# Altium schematic sheet CMX994AQ4.SchDoc
size A3; SheetNumber: 1; SheetTotal: 1
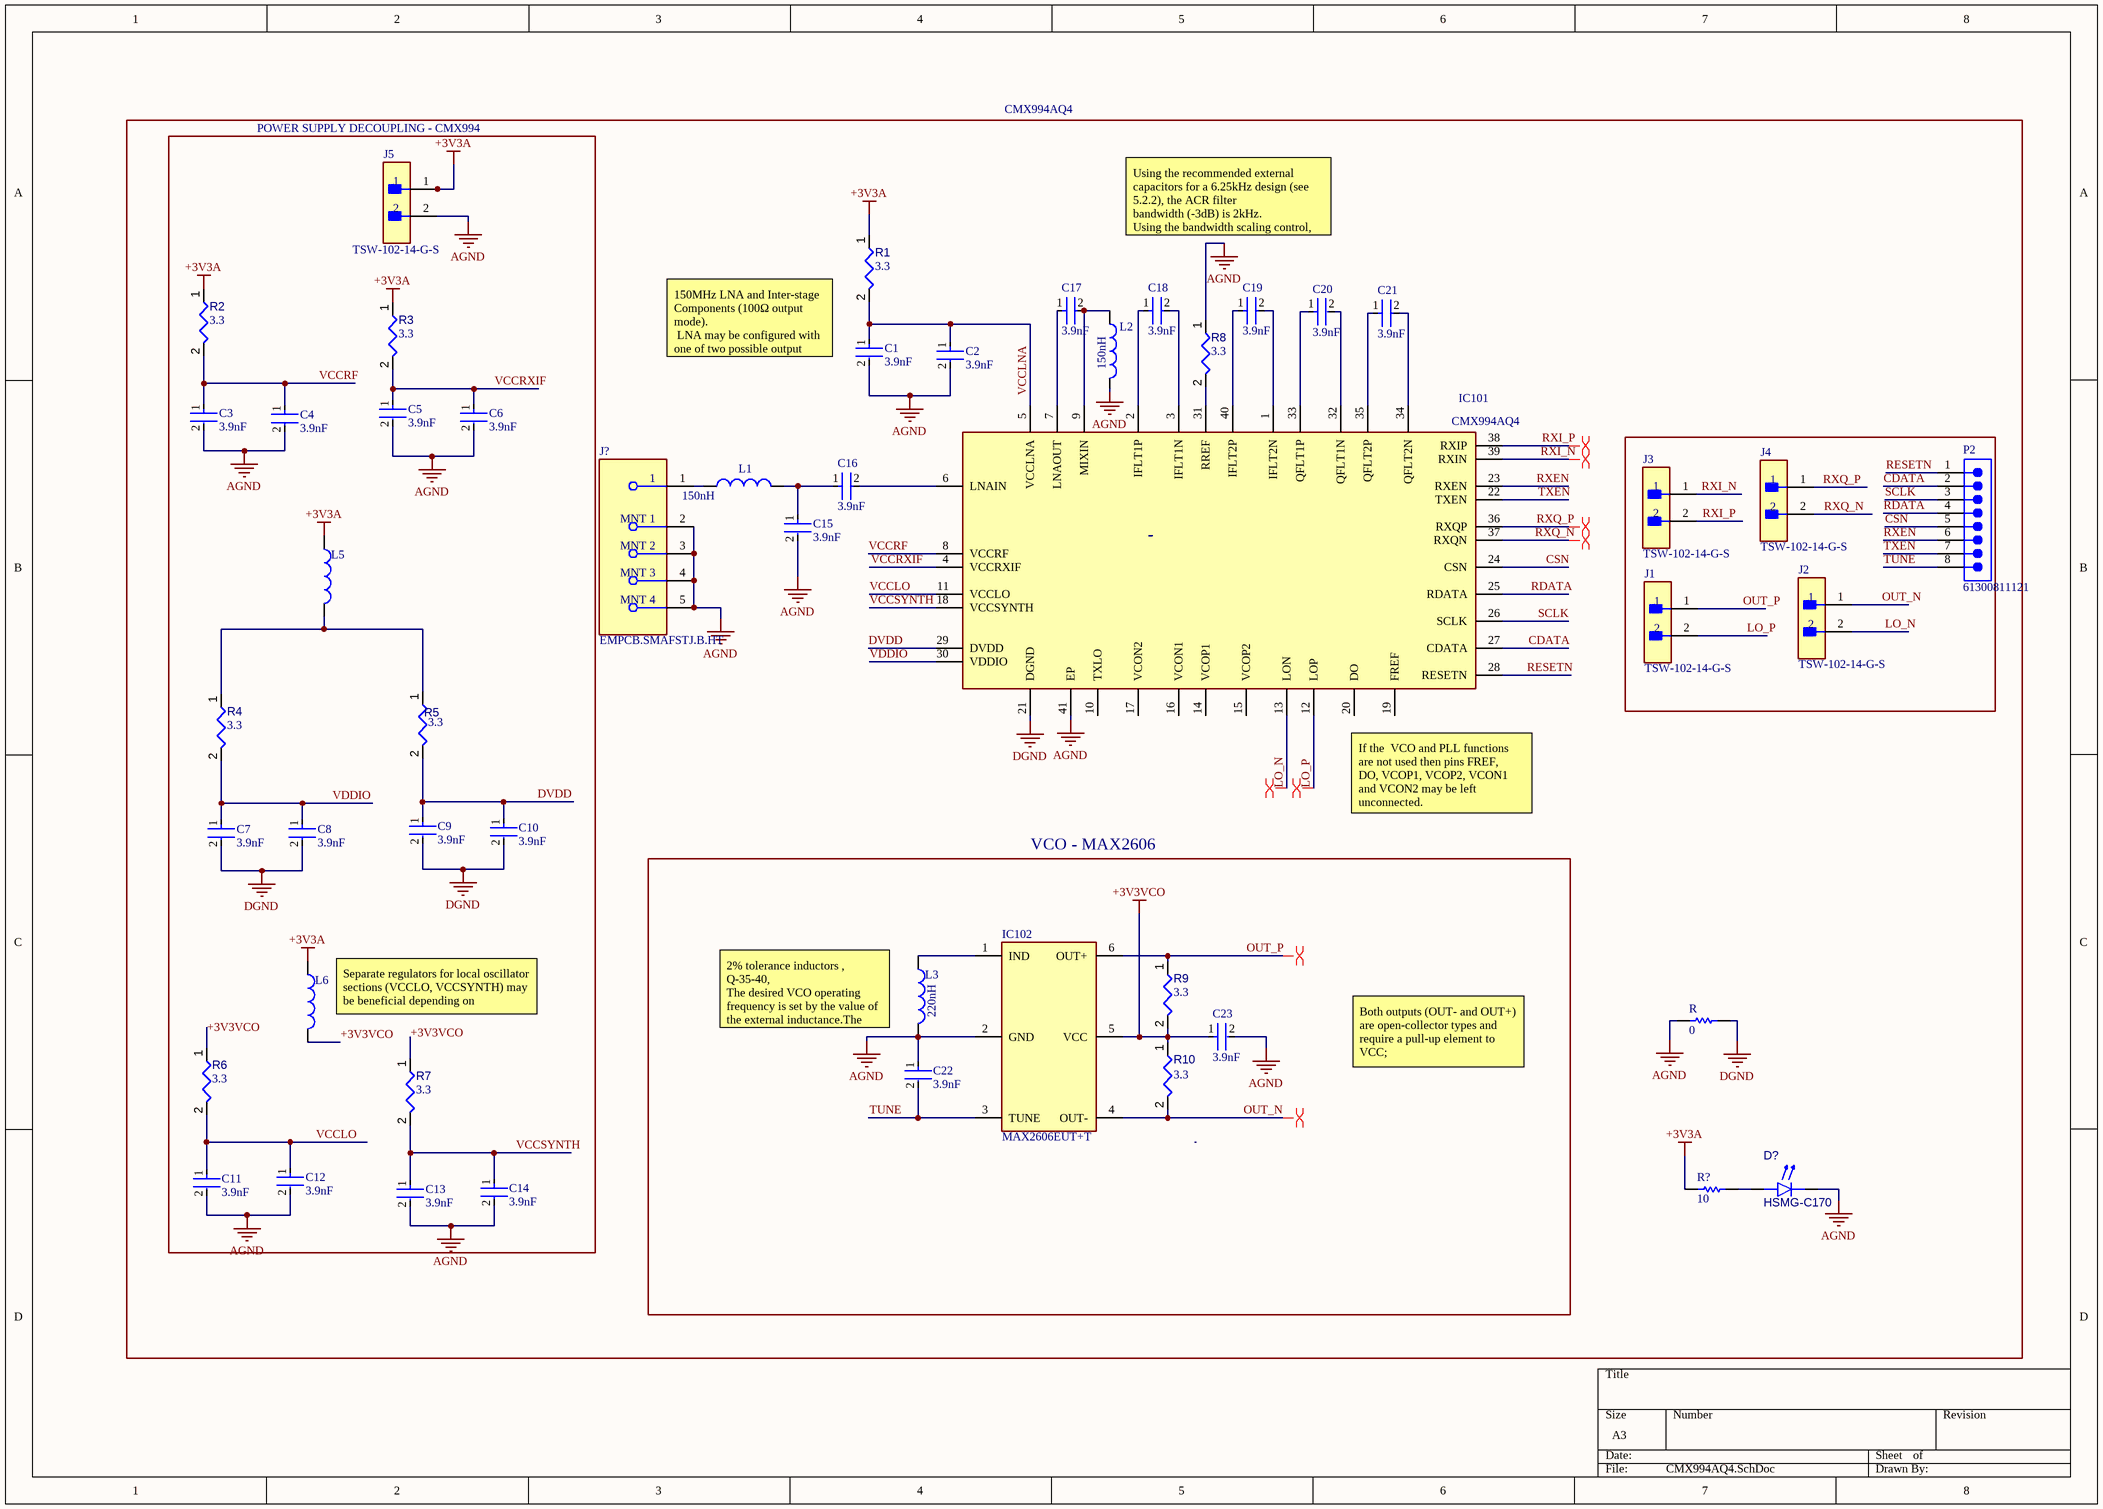
[diagram p0: CMX994AQ4.SchDoc]

## Parts
C1  value 3.9nF  [FP-CL10-IPC_B]  (hidden comment: CL10B392KB8NNND)
C2  value 3.9nF  [FP-CL10-IPC_B]  (hidden comment: CL10B392KB8NNND)
C3  value 3.9nF  [FP-CL10-IPC_B]  (hidden comment: CL10B392KB8NNND)
C4  value 3.9nF  [FP-CL10-IPC_B]  (hidden comment: CL10B392KB8NNND)
C5  value 3.9nF  [FP-CL10-IPC_B]  (hidden comment: CL10B392KB8NNND)
C6  value 3.9nF  [FP-CL10-IPC_B]  (hidden comment: CL10B392KB8NNND)
C7  value 3.9nF  [FP-CL10-IPC_B]  (hidden comment: CL10B392KB8NNND)
C8  value 3.9nF  [FP-CL10-IPC_B]  (hidden comment: CL10B392KB8NNND)
C9  value 3.9nF  [FP-CL10-IPC_B]  (hidden comment: CL10B392KB8NNND)
C10  value 3.9nF  [FP-CL10-IPC_B]  (hidden comment: CL10B392KB8NNND)
C11  value 3.9nF  [FP-CL10-IPC_B]  (hidden comment: CL10B392KB8NNND)
C12  value 3.9nF  [FP-CL10-IPC_B]  (hidden comment: CL10B392KB8NNND)
C13  value 3.9nF  [FP-CL10-IPC_B]  (hidden comment: CL10B392KB8NNND)
C14  value 3.9nF  [FP-CL10-IPC_B]  (hidden comment: CL10B392KB8NNND)
C15  value 3.9nF  [FP-CL10-IPC_B]  (hidden comment: CL10B392KB8NNND)
C16  value 3.9nF  [FP-CL10-IPC_B]  (hidden comment: CL10B392KB8NNND)
C17  value 3.9nF  [FP-CL10-IPC_B]  (hidden comment: CL10B392KB8NNND)
C18  value 3.9nF  [FP-CL10-IPC_B]  (hidden comment: CL10B392KB8NNND)
C19  value 3.9nF  [FP-CL10-IPC_B]  (hidden comment: CL10B392KB8NNND)
C20  value 3.9nF  [FP-CL10-IPC_B]  (hidden comment: CL10B392KB8NNND)
C21  value 3.9nF  [FP-CL10-IPC_B]  (hidden comment: CL10B392KB8NNND)
C22  value 3.9nF  [FP-CL10-IPC_B]  (hidden comment: CL10B392KB8NNND)
C23  value 3.9nF  [FP-CL10-IPC_B]  (hidden comment: CL10B392KB8NNND)
D?  HSMG-C170  [AVAG-HSMX-C170_V]
IC101  CMX994AQ4  [QFN50P600X600X100-41N-D]
IC102  MAX2606EUT+T  [SOT95P280X145-6N]
J1  TSW-102-14-G-S  [FP-TSW-102-14-G-S-MFG]
J2  TSW-102-14-G-S  [FP-TSW-102-14-G-S-MFG]
J3  TSW-102-14-G-S  [FP-TSW-102-14-G-S-MFG]
J4  TSW-102-14-G-S  [FP-TSW-102-14-G-S-MFG]
J5  TSW-102-14-G-S  [FP-TSW-102-14-G-S-MFG]
J?  EMPCB.SMAFSTJ.B.HT  [FP-EMPCB_SMAFSTJ_B_HT-MFG]
L1  LQM18NNR22K00D  [FP-LQM18NN_00-IPC_B]  (value not drawn)
L2  LQM18NNR22K00D  [FP-LQM18NN_00-IPC_B]  (value not drawn)
L3  LQM18NNR22K00D  [FP-LQM18NN_00-IPC_B]  (value not drawn)
L5  7427920415  [FP-7427920415-MFG]  (value not drawn)
L6  7427920415  [FP-7427920415-MFG]  (value not drawn)
P2  61300811121  [61300811121]
R  value 0  [RESC1608X55X25ML10T15]  (hidden comment: Resistor 0R +/- 5% 0603 100 mW)
R1  value 3.3  [RESC1608X55X25ML10T15]  (hidden comment: RC0603JR-073R3L)
R2  value 3.3  [RESC1608X55X25ML10T15]  (hidden comment: RC0603JR-073R3L)
R3  value 3.3  [RESC1608X55X25ML10T15]  (hidden comment: RC0603JR-073R3L)
R4  value 3.3  [RESC1608X55X25ML10T15]  (hidden comment: RC0603JR-073R3L)
R5  value 3.3  [RESC1608X55X25ML10T15]  (hidden comment: RC0603JR-073R3L)
R6  value 3.3  [RESC1608X55X25ML10T15]  (hidden comment: RC0603JR-073R3L)
R7  value 3.3  [RESC1608X55X25ML10T15]  (hidden comment: RC0603JR-073R3L)
R8  value 3.3  [RESC1608X55X25ML10T15]  (hidden comment: RC0603JR-073R3L)
R9  value 3.3  [RESC1608X55X25ML10T15]  (hidden comment: RC0603JR-073R3L)
R10  value 3.3  [RESC1608X55X25ML10T15]  (hidden comment: RC0603JR-073R3L)
R?  value 10  [RESC2013X50X30ML20T20]  (hidden comment: CRCW080510R0FKEA)

## Blocks framed on the sheet
POWER SUPPLY DECOUPLING - CMX994: C3-C14 J5 L5 L6 R2-R7
VCO - MAX2606: C22 C23 IC102 L3 R9 R10

## Nets
+3V3A: J5.1 L5.1 L6.1 R1.1 R2.1 R3.1 R?.1
+3V3VCO: C23.1 IC102.5(VCC) L6.2 R6.1 R7.1 R9.2 R10.1
AGND: C1.2 C2.2 C3.2 C4.2 C5.2 C6.2 C11.2 C12.2 C13.2 C14.2 C15.2 C22.1 C23.2 D?.1(K) IC101.41(EP) IC102.2(GND) J5.2 J?.2(MNT_1) J?.3(MNT_2) J?.4(MNT_3) J?.5(MNT_4) L2.2 L3.2 R.1 R8.1
DGND: C7.2 C8.2 C9.2 C10.2 IC101.21(DGND) R.2
CDATA: IC101.27(CDATA) P2.2
CSN: IC101.24(CSN) P2.5
DVDD: C9.1 C10.1 IC101.29(DVDD) R5.2
LO_N: IC101.13(LON) J2.2
LO_P: IC101.12(LOP) J1.2
OUT_N: IC102.4(OUT-) J2.1 R10.2
OUT_P: IC102.6(OUT+) J1.1 R9.1
RDATA: IC101.25(RDATA) P2.4
RESETN: IC101.28(RESETN) P2.1
RXEN: IC101.23(RXEN) P2.6
RXI_N: IC101.39(RXIN) J3.1
RXI_P: IC101.38(RXIP) J3.2
RXQ_N: IC101.37(RXQN) J4.2
RXQ_P: IC101.36(RXQP) J4.1
SCLK: IC101.26(SCLK) P2.3
TUNE: C22.2 IC102.3(TUNE) P2.8
TXEN: IC101.22(TXEN) P2.7
VCCLNA: C1.1 C2.1 IC101.5(VCCLNA) R1.2
VCCLO: C11.1 C12.1 IC101.11(VCCLO) R6.2
VCCRF: C3.1 C4.1 IC101.8(VCCRF) R2.2
VCCRXIF: C5.1 C6.1 IC101.4(VCCRXIF) R3.2
VCCSYNTH: C13.1 C14.1 IC101.18(VCCSYNTH) R7.2
VDDIO: C7.1 C8.1 IC101.30(VDDIO) R4.2
NetC15_1: C15.1 C16.1 L1.2
NetC16_2: C16.2 IC101.6(LNAIN)
NetC17_1: C17.1 IC101.7(LNAOUT)
NetC17_2: C17.2 IC101.9(MIXIN) L2.1
NetC18_1: C18.1 IC101.2(IFLT1P)
NetC18_2: C18.2 IC101.3(IFLT1N)
NetC19_1: C19.1 IC101.40(IFLT2P)
NetC19_2: C19.2 IC101.1(IFLT2N)
NetC20_1: C20.1 IC101.33(QFLT1P)
NetC20_2: C20.2 IC101.32(QFLT1N)
NetC21_1: C21.1 IC101.35(QFLT2P)
NetC21_2: C21.2 IC101.34(QFLT2N)
NetD?_2: D?.2(A) R?.2
NetIC101_31: IC101.31(RREF) R8.2
NetIC102_1: IC102.1(IND) L3.1
NetJ?_1: J?.1 L1.1
NetL5_2: L5.2 R4.1 R5.1

Not connected (* = marked no-connect by the designer): IC101 10(TXLO) 14(VCOP1) 15(VCOP2) 16(VCON1) 17(VCON2) 19(FREF) 20(DO)

## Layout directives
differential pair: LO_N, LO_P, OUT_N, OUT_P, RXI_N, RXI_P, RXQ_N, RXQ_P

## Notes on the sheet
- CMX994AQ4
- Using the recommended external capacitors for a 6.25kHz design (see 5.2.2), the ACR filter
  bandwidth (-3dB) is 2kHz.
  Using the bandwidth scaling control, the 2kHz filter bandwidth can then be changed to 4kHz or 8kHz (see Rx
  Control Register, section 7.3)
- 150MHz LNA and Inter-stage Components (100Ω output mode).
  LNA may be configured with one of two possible output impedance settings (100 ohm or 5 ohm). With the 50 ohm
  mode selected, there is more gain available but the circuit will consume an additional 2mA of current. The
  50 ohm mode has primarily been included for use at frequencies of 450MHz or higher.
- (near L2) 150nH
- (near L1) 150nH
- (near IC101) If the  VCO and PLL functions are not used then pins FREF,
  DO, VCOP1, VCOP2, VCON1 and VCON2 may be left unconnected.
- (near L6) Separate regulators for local oscillator sections (VCCLO, VCCSYNTH) may be beneficial depending on
  circuit noise and type of regulator and this is why two AVDD connections are shown.
- (near L3) 2% tolerance inductors , Q-35-40,
  The desired VCO operating frequency is set by the value of the external inductance.The inductor value can be taken directly from figure 2.
  Proper operation of the VCOs
  requires the use of this bypass capacitor
- (near L3) 220nH
- Both outputs (OUT- and OUT+) are open-collector types and require a pull-up element to VCC;
  C1 and C2 was selected to operating frequency of 137 Mhz
- Labels drawn without touching a wire or pin: \

## Library data of the parts
C1-C23 = CMP-001-00084-1: Ceramic Capacitor, Multilayer, Ceramic, 50V, 10% +Tol, 10% -Tol, X7R, 15% TC, 0.0039uF, Surface Mount, 0603; Case/Package: 0603; Mounting Technology: Surface Mount; Capacitor Type: Ceramic; Max Operating Temperature: 125°C; Min Operating Temperature: -55°C; RoHS Compliant: Yes; Pins: 2
D? = CMP-007-00036-1: Single Color LED, Green, Untinted Diffused, 1.4mm; Forward Voltage: 2.6V; Forward Current: 20mA; Min Operating Temperature: -40°C; Max Operating Temperature: 85°C; RoHS Compliant: Yes; Pins: 2; Mounting Technology: Surface Mount
IC101 = CMX994AQ4: Integrated Circuit; Manufacturer_Name: CML Microcircuits; Datasheet Link: https://www.mouser.in/datasheet/2/976/cml_referer_download-1660539.pdf; Height: 1mm; Manufacturer_Part_Number: CMX994AQ4; Mouser Part Number: 226-CMX994AQ4; Mouser Price/Stock: https://www.mouser.co.uk/ProductDetail/CML-Microcircuits/CMX994AQ4?qs=unwgFEO1A6syLBEO2tvR4g%3D%3D
IC102 = MAX2606EUT+T: Integrated Circuit; Manufacturer_Name: Analog Devices; Datasheet Link: https://www.mouser.co.uk/datasheet/2/256/MAX2605-MAX2609-1515582.pdf; Height: 1.45mm; Manufacturer_Part_Number: MAX2606EUT+T; Mouser Part Number: 700-MAX2606EUTT; Mouser Price/Stock: https://www.mouser.co.uk/ProductDetail/Maxim-Integrated/MAX2606EUT%2bT?qs=GxOUx7aO6nxQrK5ySdDhWg%3D%3D
J1-J5 = CMP-002-00079-1: Board Connector, 2 Contact(s), 1 Row(s), Male, Straight, 0.1 inch Pitch, Solder Terminal, Black Insulator, Receptacle; RoHS Compliant: Yes; Connector Type: BOARD CONNECTOR; Mounting Technology: Board
J? = CMP-002-00087-1: SMA Connector Jack, Female Socket 50 Ohm Board Edge, End Launch Solder
L1-L3 = CMP-006-00026-1: General Purpose Inductor, 0.22uH, 10%, 1 Element, Ferrite-Core, SMD, 0603; Max Current Rating: 50mA; Self Resonant Frequency: 150MHz; Max Operating Temperature: 85°C; RoHS Compliant: Yes; Min Operating Temperature: -40°C; Tolerance: 10%; Pins: 2
L5 L6 = CMP-006-00027-1: Ferrite Bead, 1 Function(s), 0.5A, 2 Pin(s); Current Rating: 500mA; Max Operating Temperature: 125°C; Mounting Technology: Surface Mount; Min Operating Temperature: -55°C; RoHS Compliant: Yes
P2 = CMP-002-00082-1: Board Connector, 8 Contact(s), 1 Row(s), Male, Straight, 0.1 inch Pitch, Solder Terminal, Locking, Black Insulator, Plug; RoHS Compliant: Yes; Max Operating Temperature: 125°C; Mounting Technology: Board; Connector Type: BOARD CONNECTOR; Min Operating Temperature: -40°C
R = CMP-009-00006-5: Chip Resistor, 0 Ohm, 0.1 W, -55 to 155 degC, 0603 (1608 Metric); Power: 100mW; Voltage Rating: 50V; Max Operating Temperature: 155°C; RoHS Compliant: True; Mounting Technology: SM; Case/Package: 0603; Min Operating Temperature: -55°C; Tolerance: 5%; Pins: 2
R1-R10 = CMP-009-00186-1: Fixed Resistor, Metal Glaze/thick Film, 0.1W, 3.3ohm, 75V, 5% +/-Tol, 200ppm/Cel, Surface Mount, 0603; Power: 100mW; Tolerance: 5%; Max Operating Temperature: 155°C; Case/Package: 0603; Min Operating Temperature: -55°C; Mounting Technology: Surface Mount; Pins: 2; RoHS Compliant: Yes
R? = CMP-009-00182-1: Fixed Resistor, Metal Glaze/thick Film, 0.125W, 10ohm, 150V, 1% +/-Tol, 100ppm/Cel, Surface Mount, 0805; Power: 125mW; Tolerance: 1%; Pins: 2; Max Operating Temperature: 155°C; Mounting Technology: Surface Mount; RoHS Compliant: Yes; Min Operating Temperature: -55°C; Case/Package: 0805